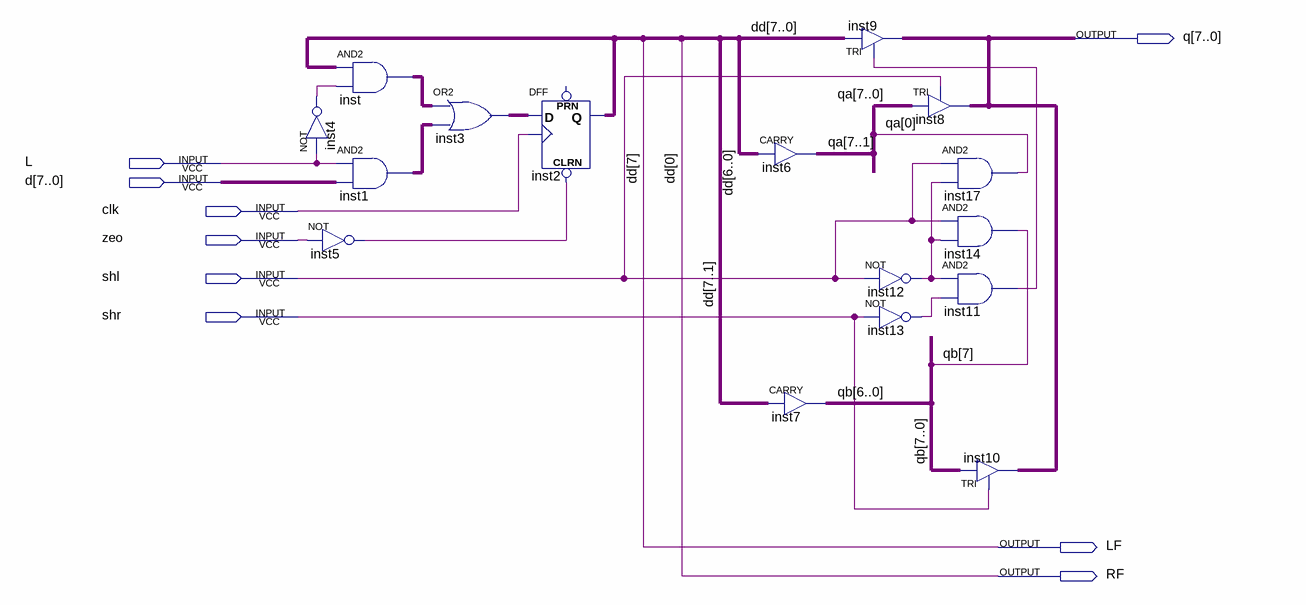
[diagram p0: schematic sheet]
// Quartus schematic ljq0.bdf as structural Verilog: 16 symbols, 9 pins
module ljq0 (
  input  L,
  input  [7:0] d,
  input  clk,
  input  zeo,
  input  shl,
  input  shr,
  output [7:0] q,
  output LF,
  output RF
);

  wire inst4_out, inst5_out, inst11_out, inst12_out, inst13_out;
  wire [6:1] dd;
  wire [7:0] inst1_out, inst3_out, inst_out, qa, qb;

  assign inst_out = {LF, dd, RF} & {8{inst4_out}};  // AND2 inst, 8 bits wide
  not inst4 (inst4_out, L);
  assign inst1_out = {8{L}} & d;  // AND2 inst1, 8 bits wide
  not inst5 (inst5_out, zeo);
  assign inst3_out = inst_out | inst1_out;  // OR2 inst3, 8 bits wide
  DFF inst2[7:0] (.CLRN(inst5_out), .CLK(clk), .D(inst3_out), .Q({LF, dd, RF}));  // open: PRN
  CARRY inst6[6:0] (.IN({dd, RF}), .OUT(qa[7:1]));
  CARRY inst7[6:0] (.IN({LF, dd}), .OUT(qb[6:0]));
  TRI inst9[7:0] (.IN({LF, dd, RF}), .OE(inst11_out), .OUT(q));
  not inst12 (inst12_out, shl);
  not inst13 (inst13_out, shr);
  TRI inst8[7:0] (.IN(qa), .OE(shl), .OUT(q));
  and inst17 (qa[0], shl, inst12_out);
  and inst14 (qb[7], shl, inst12_out);
  and inst11 (inst11_out, inst12_out, inst13_out);
  TRI inst10[7:0] (.IN(qb), .OE(shr), .OUT(q));

  // Other names for the same wires on the sheet: dd (some bits) = {LF, RF}
endmodule
